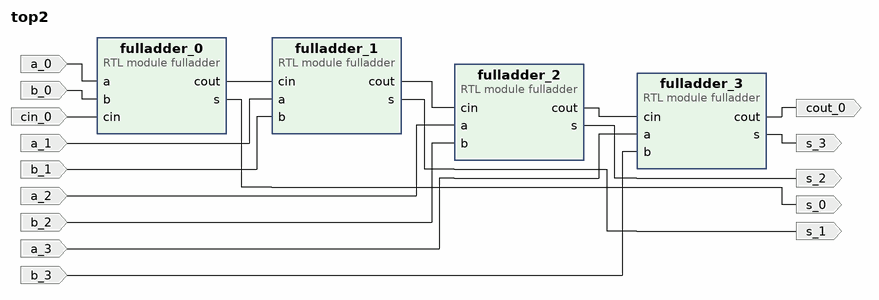
[diagram p0: block diagram of the top level]
# Vivado block design top2, xc7k70tfbv676-1, Vivado 2020.2
create_bd_design top2

create_bd_port -dir I a_0
create_bd_port -dir I b_0
create_bd_port -dir I cin_0
create_bd_port -dir O s_0
create_bd_port -dir I a_1
create_bd_port -dir I b_1
create_bd_port -dir O s_1
create_bd_port -dir I a_2
create_bd_port -dir I b_2
create_bd_port -dir O s_2
create_bd_port -dir I a_3
create_bd_port -dir I b_3
create_bd_port -dir O cout_0
create_bd_port -dir O s_3

create_bd_cell -type module -reference fulladder fulladder_0
create_bd_cell -type module -reference fulladder fulladder_1
create_bd_cell -type module -reference fulladder fulladder_2
create_bd_cell -type module -reference fulladder fulladder_3

# ---- connections ----

connect_bd_net [get_bd_pins fulladder_0/cout] [get_bd_pins fulladder_1/cin]
connect_bd_net [get_bd_pins fulladder_1/cout] [get_bd_pins fulladder_2/cin]
connect_bd_net [get_bd_pins fulladder_2/cout] [get_bd_pins fulladder_3/cin]
connect_bd_net -net a_0_1 [get_bd_ports a_0] [get_bd_pins fulladder_0/a]
connect_bd_net -net b_0_1 [get_bd_ports b_0] [get_bd_pins fulladder_0/b]
connect_bd_net -net cin_0_1 [get_bd_ports cin_0] [get_bd_pins fulladder_0/cin]
connect_bd_net [get_bd_pins fulladder_0/s] [get_bd_ports s_0]
connect_bd_net -net a_1_1 [get_bd_ports a_1] [get_bd_pins fulladder_1/a]
connect_bd_net -net b_1_1 [get_bd_ports b_1] [get_bd_pins fulladder_1/b]
connect_bd_net [get_bd_pins fulladder_1/s] [get_bd_ports s_1]
connect_bd_net -net a_2_1 [get_bd_ports a_2] [get_bd_pins fulladder_2/a]
connect_bd_net -net b_2_1 [get_bd_ports b_2] [get_bd_pins fulladder_2/b]
connect_bd_net [get_bd_pins fulladder_2/s] [get_bd_ports s_2]
connect_bd_net -net a_3_1 [get_bd_ports a_3] [get_bd_pins fulladder_3/a]
connect_bd_net -net b_3_1 [get_bd_ports b_3] [get_bd_pins fulladder_3/b]
connect_bd_net [get_bd_pins fulladder_3/cout] [get_bd_ports cout_0]
connect_bd_net [get_bd_pins fulladder_3/s] [get_bd_ports s_3]

validate_bd_design
save_bd_design
